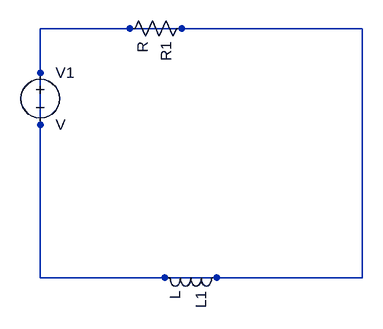
[diagram p0: schematic C134_D1_P4.jpg.asc]
C134_D1_P4.jpg.asc, the LTspice schematic file:
Version 4
SHEET 1 880 680
SYMBOL res 842 368 R90
SYMATTR InstName R1
SYMBOL voltage 608 436 R0
SYMATTR InstName V1
SYMBOL ind 896 752 R90
SYMATTR InstName L1
WIRE 608 384 1104 384
WIRE 608 384 608 768
WIRE 1104 384 1104 768
WIRE 608 768 1104 768

The netlist it stands for:
* C134_D1_P4.jpg.asc
R1 N001 N001 R
V1 N001 N001 V
L1 N001 N001 L
.backanno
.end